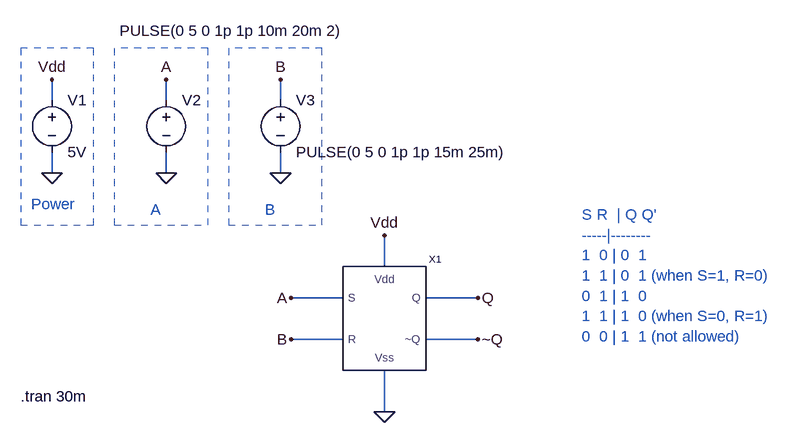
[diagram p0: schematic sr_nand_block.asc]
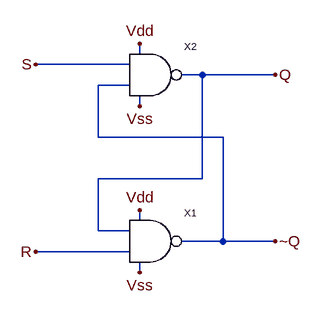
[diagram p1: sub-circuit sr_nand.asc]
sr_nand_block.asc, the LTspice schematic file:
Version 4
SHEET 1 880 680
WIRE -560 -416 -560 -448
WIRE -384 -416 -384 -448
WIRE -208 -416 -208 -448
WIRE -560 -304 -560 -336
WIRE -384 -304 -384 -336
WIRE -208 -304 -208 -336
WIRE -48 -160 -48 -208
WIRE -112 -112 -192 -112
WIRE 96 -112 16 -112
WIRE -112 -48 -192 -48
WIRE 96 -48 16 -48
WIRE -48 64 -48 0
FLAG 96 -112 Q
FLAG -192 -112 A
FLAG -48 -208 Vdd
FLAG -48 64 0
FLAG -560 -304 0
FLAG -560 -448 Vdd
FLAG -384 -304 0
FLAG -384 -448 A
FLAG -192 -48 B
FLAG -208 -304 0
FLAG -208 -448 B
FLAG 96 -48 ~Q
SYMBOL voltage -560 -432 R0
WINDOW 123 0 0 Left 0
WINDOW 39 0 0 Left 0
SYMATTR InstName V1
SYMATTR Value 5V
SYMBOL voltage -384 -432 R0
WINDOW 123 0 0 Left 0
WINDOW 39 0 0 Left 0
WINDOW 3 -72 -91 Left 2
SYMATTR Value PULSE(0 5 0 1p 1p 10m 20m 2)
SYMATTR InstName V2
SYMBOL voltage -208 -432 R0
WINDOW 123 0 0 Left 0
WINDOW 39 0 0 Left 0
SYMATTR InstName V3
SYMATTR Value PULSE(0 5 0 1p 1p 15m 25m)
SYMBOL sr_nand -112 0 R0
SYMATTR InstName X1
TEXT -592 -256 Left 2 ;Power
TEXT -408 -248 Left 2 ;A
TEXT -608 40 Left 2 !.tran 30m
TEXT -232 -248 Left 2 ;B
TEXT 256 -240 Left 2 ;S R  | Q Q'\n-----|--------\n1  0 | 0  1\n1  1 | 0  1 (when S=1, R=0)\n0  1 | 1  0\n1  1 | 1  0 (when S=0, R=1)\n0  0 | 1  1 (not allowed)
RECTANGLE Normal -496 -496 -608 -224 2
RECTANGLE Normal -320 -496 -464 -224 2
RECTANGLE Normal -144 -496 -288 -224 2

sr_nand.asc, the sub-circuit schematic file:
Version 4
SHEET 1 880 680
WIRE -176 -240 -176 -256
WIRE -192 -224 -336 -224
WIRE -80 -208 -112 -208
WIRE 32 -208 -80 -208
WIRE -192 -192 -240 -192
WIRE -176 -160 -176 -176
WIRE -240 -112 -240 -192
WIRE -48 -112 -240 -112
WIRE -80 -48 -80 -208
WIRE -80 -48 -240 -48
WIRE -176 16 -176 0
WIRE -240 32 -240 -48
WIRE -192 32 -240 32
WIRE -48 48 -48 -112
WIRE -48 48 -112 48
WIRE 32 48 -48 48
WIRE -192 64 -336 64
WIRE -176 96 -176 80
FLAG -176 -256 Vdd
FLAG -176 0 Vdd
FLAG -176 -160 Vss
FLAG -176 96 Vss
FLAG -336 -224 S
FLAG -336 64 R
FLAG 32 -208 Q
FLAG 32 48 ~Q
SYMBOL nand -192 80 R0
SYMATTR InstName X1
SYMBOL nand -192 -176 R0
SYMATTR InstName X2

The netlist it stands for:
* sr_nand_block.asc
V1 Vdd 0 5V
V2 A 0 PULSE(0 5 0 1p 1p 10m 20m 2)
V3 B 0 PULSE(0 5 0 1p 1p 15m 25m)
XX1 A B Q ~Q Vdd 0 sr_nand

* block symbol definitions
.subckt sr_nand S R Q ~Q Vdd Vss
XX1 Q R ~Q Vdd Vss nand  ; pins A B Y Vdd Vss
XX2 S ~Q Q Vdd Vss nand  ; pins A B Y Vdd Vss
.ends sr_nand

* Power
* A
.tran 30m
* B
* S R  | Q Q'
* -----|--------
* 1  0 | 0  1
* 1  1 | 0  1 (when S=1, R=0)
* 0  1 | 1  0
* 1  1 | 1  0 (when S=0, R=1)
* 0  0 | 1  1 (not allowed)
.backanno
.end